# EAGLE design Adafruit Feather M0 Express test (EAGLE 9.5.2)
COMPANY: ADAFRUIT INDUSTRIES; DRAWN: KTOWN; REV: B
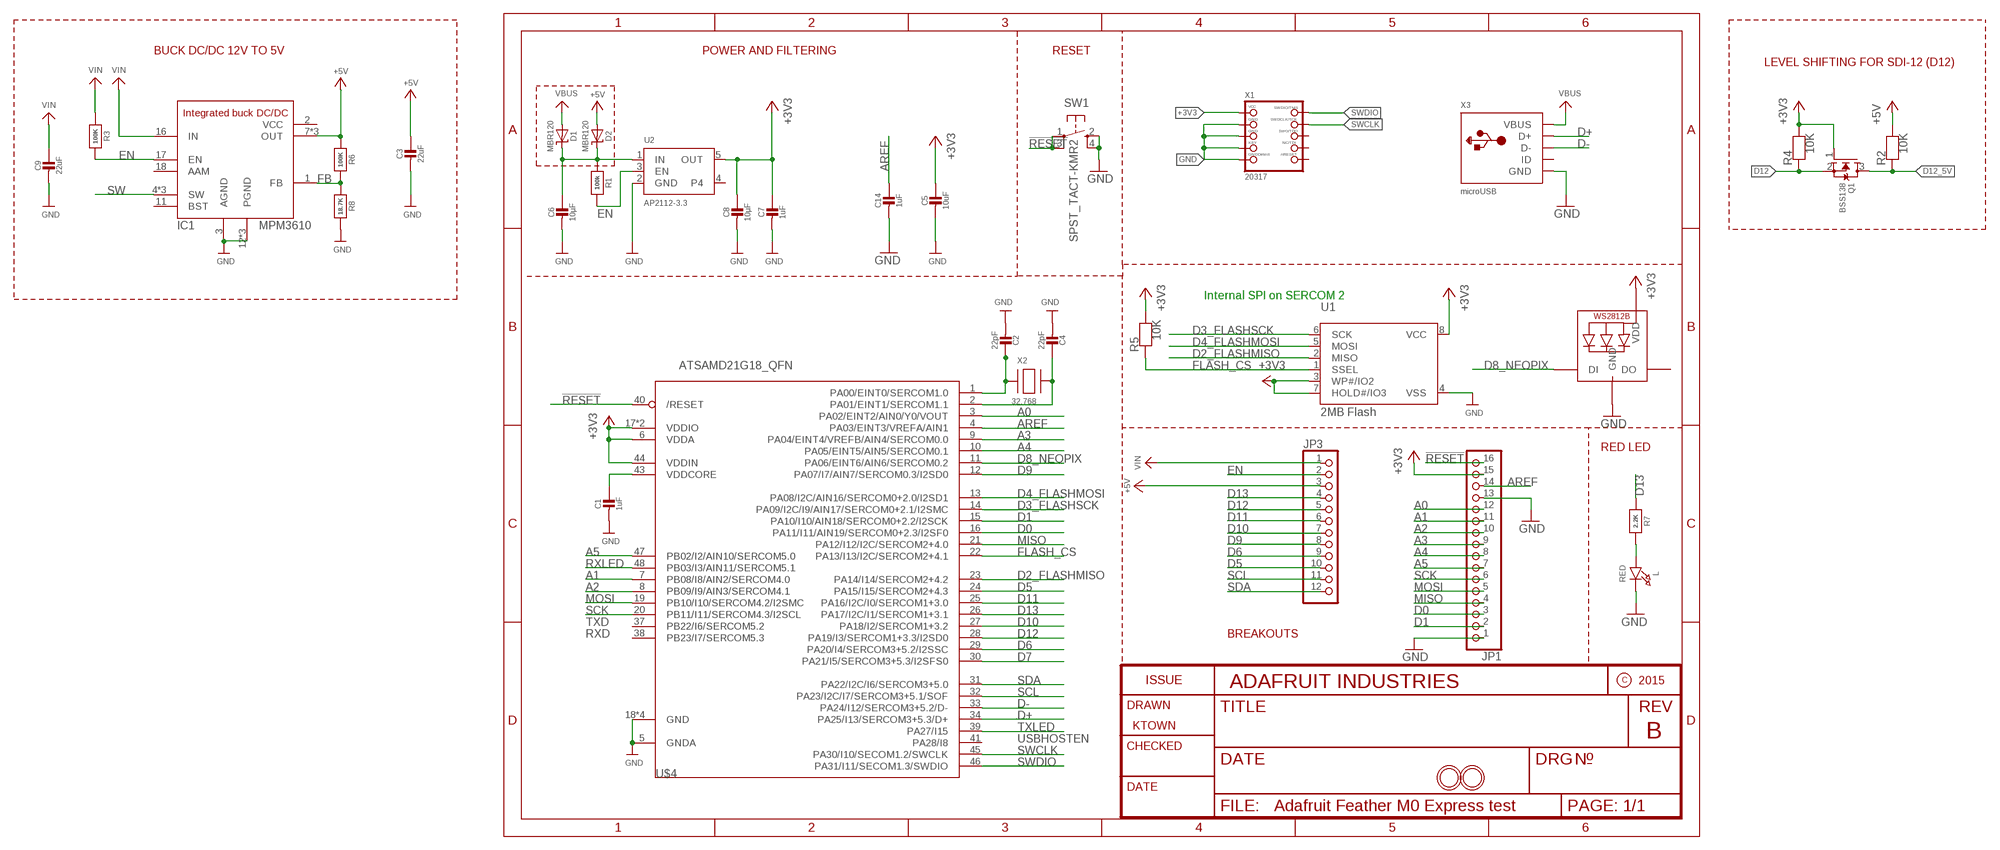
[diagram p0: schematic, sheet 1]

## Parts
C1  1uF  CAP_CERAMIC0603_NO  [0603-NO]
C2  22pF  CAP_CERAMIC0603_NO  [0603-NO]
C3  22uF  CAP_CERAMIC0805-NOOUTLINE  [0805-NO]
C4  22pF  CAP_CERAMIC0603_NO  [0603-NO]
C5  10uF  CAP_CERAMIC0805-NOOUTLINE  [0805-NO]
C6  10µF  CAP_CERAMIC0805-NOOUTLINE  [0805-NO]
C7  1uF  CAP_CERAMIC0603_NO  [0603-NO]
C8  10µF  CAP_CERAMIC0805-NOOUTLINE  [0805-NO]
C9  22uF  CAP_CERAMIC0805-NOOUTLINE  [0805-NO]
C14  1uF  CAP_CERAMIC0603_NO  [0603-NO]
D1  MBR120  DIODE-SCHOTTKYSOD-123  [SOD-123]
D2  MBR120  DIODE-SCHOTTKYSOD-123  [SOD-123]
IC1  MPM3610  [MPM3610]
JP1  HEADER-1X16ROUND  [1X16_ROUND]
JP3  HEADER-1X12  [1X12_ROUND]
L  RED  LED0805_NOOUTLINE  [CHIPLED_0805_NOOUTLINE]
LED1  WS2812B3535  [LED3535]
Q1  BSS138  MOSFET-NREFLOW  [SOT23]
R1  100k  RESISTOR_0603_NOOUT  [0603-NO]
R2  10K  RESISTOR_0603_NOOUT  [0603-NO]
R3  100K  RESISTOR_0603_NOOUT  [0603-NO]
R4  10K  RESISTOR_0603_NOOUT  [0603-NO]
R5  10K  RESISTOR_0603_NOOUT  [0603-NO]
R6  100K  RESISTOR_0603_NOOUT  [0603-NO]
R7  2.2K  RESISTOR_0603_NOOUT  [0603-NO]
R8  18.7K  RESISTOR_0603_NOOUT  [0603-NO]
SW1  SPST_TACT-KMR2  [KMR2]
U1  2MB Flash  SPIFLASH_SOIC8208MIL  [SOIC8_208MIL]
U2  AP2112-3.3  VREG_SOT23-5  [SOT23-5]
U$4  ATSAMD21G18_QFN  ATSAMD21G_QFN  [TQFN48_7MM]
U$31  MOUNTINGHOLE2.5  [MOUNTINGHOLE_2.5_PLATED]
U$32  MOUNTINGHOLE2.5  [MOUNTINGHOLE_2.5_PLATED]
X1  20317  JTAG-CORTEXBOXPOSTS  [2X05_1.27MM_BOX_POSTS]
X2  32.768  XTAL-3.2X1.5  [XTAL3215]
X3  microUSB  USB_MICRO_20329_V2  [4UCONN_20329_V2]

## Nets
!RESET: JP1.16 SW1.1(P) SW1.3(P1) U$4.40(/RESET)
+3V3: C5.1 C7.1 C8.1 JP1.15 LED1.2(VDD) Q1.1(G) R4.2 R5.2 U1.3(WP#/IO2) U1.7(HOLD#/IO3) U1.8(VCC) U2.5(OUT) U$4.6(VDDA) U$4.17(VDDIO) U$4.36(VDDIO) U$4.44(VDDIN) X1.1(VCC)
+5V: C3.1 D2.A IC1.7(OUT) IC1.8(OUT) IC1.9(OUT) JP3.3 R2.2 R6.1
A0: JP1.12 U$4.3(PA02/EINT2/AIN0/Y0/VOUT)
A1: JP1.11 U$4.7(PB08/I8/AIN2/SERCOM4.0)
A2: JP1.10 U$4.8(PB09/I9/AIN3/SERCOM4.1)
A3: JP1.9 U$4.9(PA04/EINT4/VREFB/AIN4/SERCOM0.0)
A4: JP1.8 U$4.10(PA05/EINT5/AIN5/SERCOM0.1)
A5: JP1.7 U$4.47(PB02/I2/AIN10/SERCOM5.0)
AREF: C14.1 JP1.14 U$4.4(PA03/EINT3/VREFA/AIN1)
D0: JP1.3 U$4.16(PA11/I11/AIN19/SERCOM0+2.3/I2SF0)
D1: JP1.2 U$4.15(PA10/I10/AIN18/SERCOM0+2.2/I2SCK)
D2_FLASHMISO: U1.2(MISO) U$4.23(PA14/I14/SERCOM2+4.2)
D3_FLASHSCK: U1.6(SCK) U$4.14(PA09/I2C/I9/AIN17/SERCOM0+2.1/I2SMC)
D4_FLASHMOSI: U1.5(MOSI) U$4.13(PA08/I2C/AIN16/SERCOM0+2.0/I2SD1)
D5: JP3.10 U$4.24(PA15/I15/SERCOM2+4.3)
D6: JP3.9 U$4.29(PA20/I4/SERCOM3+5.2/I2SSC)
D7: U$4.30(PA21/I5/SERCOM3+5.3/I2SFS0)
D8_NEOPIX: LED1.1(DI) U$4.11(PA06/EINT6/AIN6/SERCOM0.2)
D9: JP3.8 U$4.12(PA07/I7/AIN7/SERCOM0.3/I2SD0)
D10: JP3.7 U$4.27(PA18/I2/SERCOM1+3.2)
D11: JP3.6 U$4.25(PA16/I2C/I0/SERCOM1+3.0)
D12: JP3.5 Q1.2(S) R4.1 U$4.28(PA19/I3/SERCOM1+3.3/I2SD0)
D12_5V: Q1.3(D) R2.1
D13: JP3.4 R7.1 U$4.26(PA17/I2C/I1/SERCOM1+3.1)
D+: U$4.34(PA25/I13/SERCOM3+5.3/D+) X3.D+
D-: U$4.33(PA24/I12/SERCOM3+5.2/D-) X3.D-
EN: IC1.17(EN) JP3.2 R1.2 R3.2 U2.3(EN)
FB: IC1.1(FB) R6.2 R8.1
FLASH_CS: R5.1 U1.1(SSEL) U$4.22(PA13/I13/I2C/SERCOM2+4.1)
GND: C1.2 C2.2 C3.2 C4.2 C5.2 C6.2 C7.2 C8.2 C9.2 C14.2 IC1.3(AGND) IC1.12(PGND) IC1.13(PGND) IC1.14(PGND) JP1.1 JP1.13 L.C LED1.4(GND) R8.2 SW1.2(S) SW1.4(S1) U1.4(VSS) U2.2(GND) U$4.5(GNDA) U$4.18(GND) U$4.35(GND) U$4.42(GND) U$4.THERMAL(GND) X1.3(GND) X1.5(GND) X1.7(KEY) X1.9(GNDDETECT) X3.BASE@1(GND) X3.BASE@2(GND) X3.GND X3.SPRT@1(GND) X3.SPRT@2(GND) X3.SPRT@3(GND) X3.SPRT@4(GND)
MISO: JP1.4 U$4.21(PA12/I12/I2C/SERCOM2+4.0)
MOSI: JP1.5 U$4.19(PB10/I10/SERCOM4.2/I2SMC)
N$1: C6.1 D1.C D2.C R1.1 U2.1(IN)
N$2: L.A R7.2
N$5: C2.1 U$4.1(PA00/EINT0/SERCOM1.0) X2.P$1
N$7: C4.1 U$4.2(PA01/EINT1/SERCOM1.1) X2.P$2
RXLED: U$4.48(PB03/I3/AIN11/SERCOM5.1)
SCK: JP1.6 U$4.20(PB11/I11/SERCOM4.3/I2SCL)
SCL: JP3.11 U$4.32(PA23/I2C/I7/SERCOM3+5.1/SOF)
SDA: JP3.12 U$4.31(PA22/I2C/I6/SERCOM3+5.0)
SW: IC1.4(SW) IC1.5(SW) IC1.6(SW)
SWCLK: U$4.45(PA30/I10/SECOM1.2/SWCLK) X1.4(SWDCLK)
SWDIO: U$4.46(PA31/I11/SECOM1.3/SWDIO) X1.2(SWDIO)
TXLED: U$4.39(PA27/I15)
VBUS: D1.A X3.VBUS
VDDCORE: C1.1 U$4.43(VDDCORE)
VIN: C9.1 IC1.16(IN) JP3.1 R3.1
Unconnected: IC1.11(BST) IC1.18(AAM) LED1.3(DO) U2.4 U$4.37(PB22/I6/SERCOM5.2) U$4.38(PB23/I7/SERCOM5.3) U$4.41(PA28/I8) X1.6(SWO) X1.8(TDI) X1.10(NRESET) X3.ID

## Notes on the sheet
- BUCK DC/DC 12V TO 5V | POWER AND FILTERING | RESET
- LEVEL SHIFTING FOR SDI-12 (D12)
- Internal SPI on SERCOM 2
- RED LED
- TXD
- RXD | BREAKOUTS
- USBHOSTEN

## Power pins joined to a net without a drawn wire
VCC: IC1.2(VCC)

## Library data of the parts
C1-C9 C14 = microbuilder:CAP_CERAMIC: Ceramic Capacitors For new designs, use the packages preceded by an '_' character since they are more reliable: The following footprints should be used on most boards: _0402 - Standard footprint for regular board layouts _0603 - Standard footprint for regular board layouts _0805 - Standard footprint for regular board layouts _1206 - Standard footprint for regular board layouts For extremely tight-pitch boards where space is at a premium, the following 'micro-pitch' footprints can be used (smaller pads, no silkscreen outline, etc.): _0402MP - Micro-pitch footprint for very dense/compact boards _0603MP - Micro-pitch footprint for very dense/compact boards _0805MP - Micro-pitch footprint for very dense/compact boards _1206MP - Micro-pitch footprint for very dense/compact boards
D1 D2 = microbuilder:DIODE-SCHOTTKY
IC1 = microbuilder:MPM3610
JP1 = microbuilder:HEADER-1X16: PIN HEADER
JP3 = microbuilder:HEADER-1X12
L = microbuilder:LED: LED 0603 - 0603 Surface Mount Package 2mA: Green LED - Low Power (3.9mcd, 2ma, 1.7Vf) - Digikey: 475-2709-2-ND Orange LED - Low Power (9.8mcd, 2ma, 1.8Vf) - Digikey: 475-1194-2-ND Red LED - Low Power (5mcd, 2ma, 1.8Vf) - Digikey: 475-1195-2-ND Yellow LED - Low Power (7mcd, 2ma, 1.8Vf) - Digikey: 475-1196-2-ND 5mA: Blue LED - Low Power (17mcd, 5ma, 2.9Vf) - Digikey: LNJ937W8CRACT-ND 0805 - 0805 Surface Mount Package 2mA: Red LED (8.8mcd, 2mA, 1.8Vf, Clear) - Low Power [Digikey: 475-2510-1-ND] Green LED (5mcd, 2mA, 1.8Vf, Clear) - Low Power [Digikey: 475-2730-1-ND] Yellow LED (11.3mcd, 2mA, 1.8Vf, Clear) - Low Power [Digikey: 475-2555-1-ND] 20mA: Red LED (104mcd, 20mA, Diffused) - LS R976 [Digikey: 475-1278-6-ND] Red LED (12mcd, 20mA, 2.0Vf, Clear) - APT2012EC [Digikey: 754-1128-1-ND] Green LED (15mcd, 20mA, 2.2Vf, Clear) - APT2012GC [Digikey: 754-1131-1-ND] Orange LED (160mcd, 20mA, 2.1Vf, Clear) - APT2012SECK [Digikey: 754-1130-1-ND] 1206 - 1206 Surface Mount Package Green LED (26mcd, 20mA, Diffused) - LG N971 [Digikey: 475-1407-6-ND] Red LED (15mcd, 20mA, Diffused) - LH N974 [Digikey: 475-1416-6-ND] Cree - Cree High-Power Surface Mount LEDs XPEBWT-L1-0000-00D50 - White 111lm 350mA 2.9Vf 6200K 110° XTEAWT-00-0000-00000LEE3 - White 114lm 350mA 2.85Vf 5000K 115° Everlight - Everlight 45-21 Series Surface Mount LEDs 45-21/QK2C-B2832AC2CB2/2T - Warm White 2000mcd 20mA 3.25Vf 3050K 120° 45-21/LK2C-B38452C4CB2/2T - Nuetral White 2000mcd 20mA 3.25Vf 4150K 120° 45-21/LK2C-B50634C6CB2/2T - Cold White 2200mcd 20mA 3.25Vf 5650K 120° PLCC2 Reverse Mount LS T77K-J1L2-1-0-2-R18-Z - Red 11.25mcd 2mA 1.8Vf 630nm 120° LO T77K-L1M2-24-Z - Orange 19.6mcd 2mA 1.8Vf 606nm 120° LY T77K-K2M1-26-Z - Yellow 15.7mcd 2mA 1.8Vf 587nm 120°
LED1 = microbuilder:WS2812B
Q1 = adafruit:MOSFET-N: N-Channel Mosfet 2N7002E - 60V 260mA SOT23 [Digikey: 2N7002ET1GOSTR-ND] - REEL BSH103 - 30V 850mA SOT23 [Digikey: 568-5013-1-ND]
R1-R8 = microbuilder:RESISTOR: Resistors For new designs, use the packages preceded by an '_' character since they are more reliable: The following footprints should be used on most boards: _0402 - Standard footprint for regular board layouts _0603 - Standard footprint for regular board layouts _0805 - Standard footprint for regular board layouts _1206 - Standard footprint for regular board layouts For extremely tight-pitch boards where space is at a premium, the following 'micro-pitch' footprints can be used (smaller pads, no silkscreen outline, etc.): _0402MP - Micro-pitch footprint for very dense/compact boards _0603MP - Micro-pitch footprint for very dense/compact boards _0805MP - Micro-pitch footprint for very dense/compact boards _1206MP - Micro-pitch footprint for very dense/compact boards
SW1 = adafruit:SPST_TACT: SMT 6mm switch, EVQQ2 series http://www.ladyada.net/library/eagle
U1 = microbuilder:SPIFLASH_SOIC8: SOIC8 SPI Flash Be careful with the size since SOIC8 flash comes in several 'widths' SOIC8 150 mil M25P16 - 16Mbit (2Mbit x 8) Serial Flash (75MHz SPI Bus), Supply: 2.7-3.6V Digikey: SOIC8 - M25P16-VMN6P-ND SOIC8 208 mil W25Q16BVSSIG - 16Mbit (2Mbit x 8) Serial Flash (104MHz SPI Bus), Supply: 2.7-3.6V Digikey: SOIC8 - W25Q16BVSSIG-ND
U2 = microbuilder:VREG_SOT23-5: SOT23-5 Fixed Voltage Regulators Part Current Out V Out V In V Dropout θJA (°C/W) TJ (°C) Digikey Part No. ADP121 150mA 3.3V 3.4-5.5V 0.09V @ 150mA -- -- ADP121-AUJZ33R7CT-ND ADP121 150mA 3.0V 3.1-5.5V 0.09V @ 150mA -- -- ADP121-AUJZ30R7CT-ND ADP122 300mA 3.3V 3.4-5.5V 0.085V @ 300mA -- -- ADP122AUJZ-3.3-R7CT-ND ADP1712 300mA 3.3V 3.5-5.5V 0.17V @ 300mA -- -- ADP1712AUJZ-3.3-R7TR-ND AP7311 (Low Cost) 150mA 3.3V 3.5-6V 0.15V @ 150mA -- -- AP7311-33WG-7DICT-ND LD39015M18R 150mA 1.8V 1.9V-5.5V 0.08V @ 100mA -- -- 497-6977-1-ND LP2985A-33DBVR 150mA 3.3V 3.3-16V 0.28V @ 150mA 206 150 296-18479-1-ND MCP1824T-3302E/OT 300mA 3.3V 3.5V-6V 0.2V @ 300mA -- -- MCP1824T-3302E/OTCT-ND MIC5205-2.5YM5 TR 150mA 2.5V 2.7-16V 0.165V @ 150mA -- -- 576-1257-2-ND MIC5205-3.0YM5 TR 150mA 3.0V 3.2V-16V 0.165V @ 150mA -- -- 576-1258-2-ND MIC5205-3.3YM5 TR 150mA 3.3V 3.5V-16V 0.165V @ 150mA -- -- 576-1259-2-ND TPS780330220 150mA 3.3V+2.2V 3.6-5.5V 250mV Max -- -- 296-23332-1-ND TDA3663/N1,135 100mA 3.3V 3.5-45V 0.18V @ 50mA -- -- 568-5343-1-ND Max operating temp can be calculated using θJA, TJ (max junction temperature), and power in watts. Set the "Maximum Ambient Temperature" until it reaches TJ ("Max Junction Temperature"), which is the absolute limit for safe use of the regulator: Heat Sink Temperature Calculator <http://www.daycounter.com/Calculators/Heat-Sink-Temperature-Calculator.phtml> For example, With 12V source into a 3.3V LP2985 and a 30mA load, we are dissipating (12V-3.3V) * 0.03A = 0.261W. With a θJA of 206 °C/W, a TJ of 150°C, and 261mW we can safely use the chip without a heat sink up to 75°C (=147.1°C Junction Temperature).
U$4 = microbuilder:ATSAMD21G
U$31 U$32 = microbuilder:MOUNTINGHOLE: Mounting Hole For #2 screws (0.086"/2.18mm width, 0.094"/2.4mm hole) use 2.5mm; BOM: EXCLUDE
X1 = microbuilder:JTAG-CORTEX: Serial Wire (SW-DP) Connector Standard 0.05" 10-pin connector is for use with the Cortex M and Cortex A SWD (serial wire debugger) interface (SW-DP) Connectors 2x05_1.27MM_SMT - Inexpensive surface-mount header with bare pins, compatible with standard 10-pin SWD cables (4UCON: 16846) 2x05_1.27MM_BOX_NOPOSTS - Polarised surface-mount box (4UCON with caps: 19735, without caps: 15117 2x05_1.27MM_BOX_POSTS - Polarised surface-mount box with mounting holes (4UCON: 20317) Pinout: http://infocenter.arm.com/help/topic/com.arm.doc.faqs/attached/13634/cortex_debug_connectors.pdf http://www.keil.com/peripherals/coresight/connectors.asp
X2 = adafruit2:XTAL: Low cost SMT crystals, no capacitors included http://www.ladyada.net/library/eagle
X3 = microbuilder:USB: USB Connectors USBMINIB - Surface Mount Female Mini-B USB Connector 4UConnector: 06564

## Board
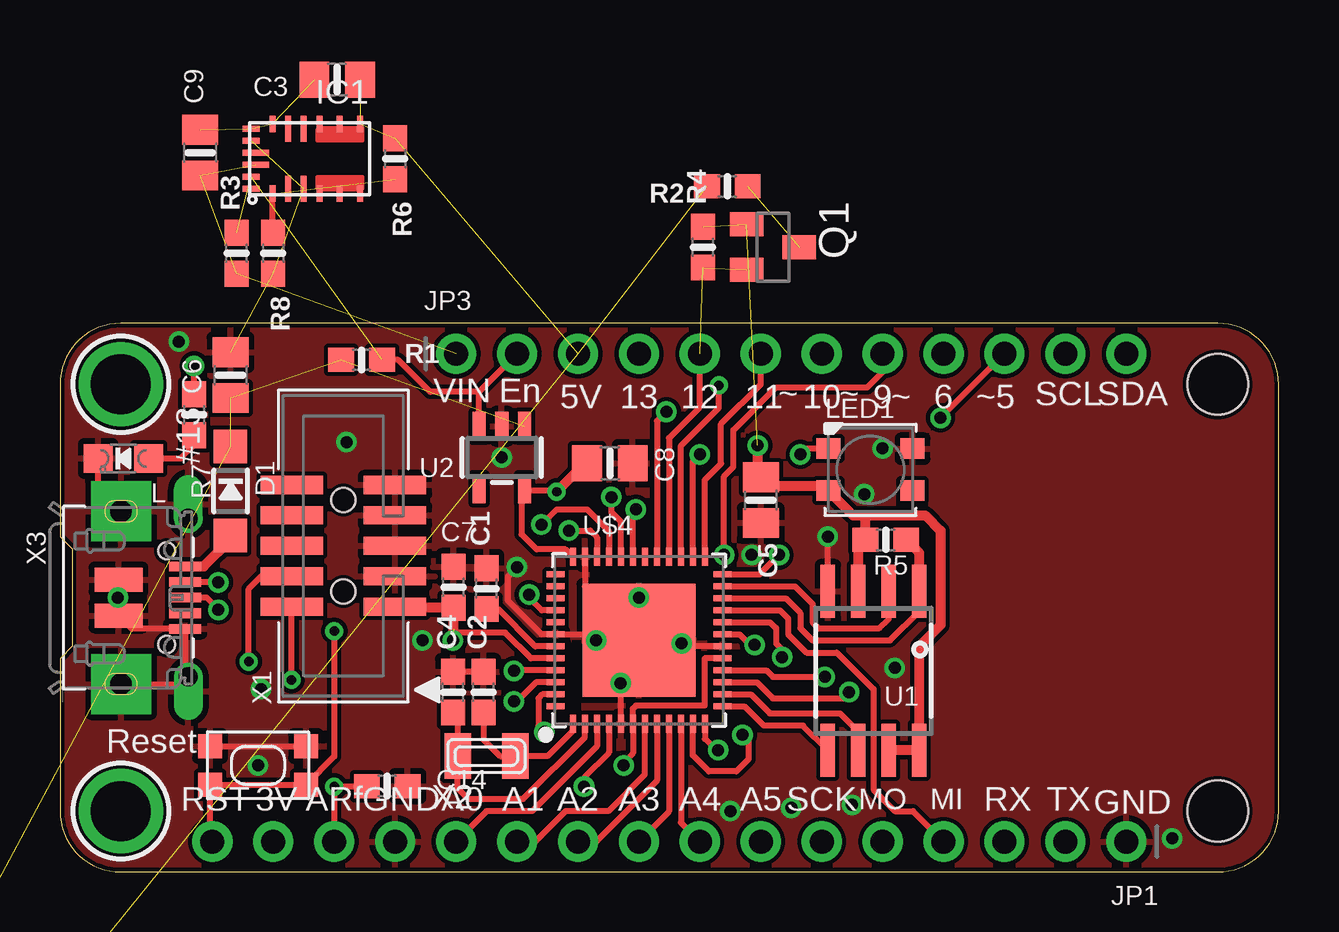
[diagram p1: board, top side]
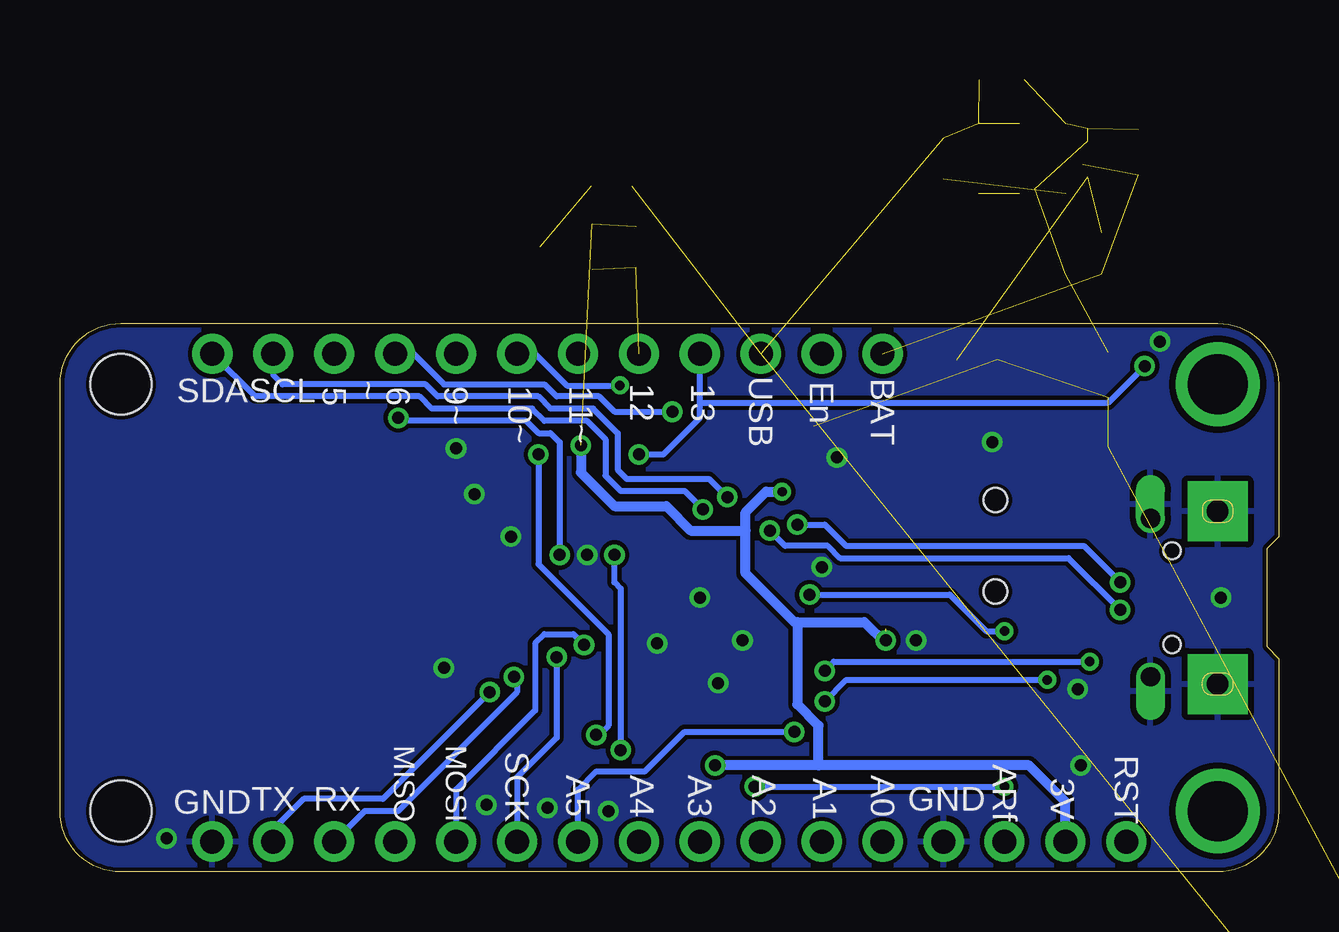
[diagram p2: board, bottom side, seen from below]

Size 50.8 x 22.86 mm. Coordinates in mm from the lower left corner, seen from the top.
Outline: 2.54,0 48.26,0 arc90 50.8,2.54 50.8,20.32 arc90 48.26,22.86 2.54,22.86 arc90 0,20.32 0,13.97 0.51,13.46 0.51,9.4 0,8.89 0,2.54 arc90 2.54,0
Copper layers (1*16): Top 0.035mm / dielectric 1.5mm / Bottom 0.035mm
Design rules "SparkFun-2-layer-TIGHT *": minimum track width 7mil, minimum drill 15mil, track to track 7mil, track to pad 7mil, pad to pad 7mil, via to via 7mil, smd to smd 7mil, copper to edge 7mil, drill to drill 7mil, minimum pad ring 7mil, minimum via ring 7mil, stop-mask expansion 4mil, vias tented up to drill 25mil, thermal gap 10mil
Holes 2.54 mm at 48.26,20.32 48.26,2.54
tRestrict: area 21.3,6.9 to 21.7,9.7; area 22.1,12.1 to 27.1,12.4; area 26.5,9.7 to 27.1,12.2

### Footprints (pad centres in the part's own frame; a part is rotated, then mirrored left to right if it is on the bottom)
0603-NO = smd 1.075 x 1: 1 -0.85,0; 2 0.85,0
0805-NO = smd 1.24 x 1.5: 1 -0.95,0; 2 0.95,0
SOD-123 = smd 1.4 x 1.4: A 1.85,0; C -1.85,0
MPM3610 = smd 0.7 x 0.25: 1 -1.45,1.55; 4 -1.45,-0.4; 5 -1.45,-1.25; 6 -1.45,-2.1; 7 1.45,-2.1; 8 1.45,-1.25; 9 1.45,-0.4; 12 1.45,1.55 | smd 1.1 x 0.25: 2 -1.25,0.9; 3 -1.25,0.25; 10 1.25,0.25; 11 1.25,0.9 | smd 0.25 x 0.7: 13 1.25,2.45; 14 0.75,2.45; 17 -0.75,2.45; 18 -1.25,2.45 | smd 0.25 x 1.1: 15 0.25,2.25; 16 -0.25,2.25
1X16_ROUND = drill 1 pad 1.676: 1 -19.05,0; 2 -16.51,0; 3 -13.97,0; 4 -11.43,0; 5 -8.89,0; 6 -6.35,0; 7 -3.81,0; 8 -1.27,0; 9 1.27,0; 10 3.81,0; 11 6.35,0; 12 8.89,0; 13 11.43,0; 14 13.97,0; 15 16.51,0; 16 19.05,0
1X12_ROUND = drill 1 pad 1.676: 1 -13.97,0; 2 -11.43,0; 3 -8.89,0; 4 -6.35,0; 5 -3.81,0; 6 -1.27,0; 7 1.27,0; 8 3.81,0; 9 6.35,0; 10 8.89,0; 11 11.43,0; 12 13.97,0
CHIPLED_0805_NOOUTLINE = smd 1.2 x 1.2: A 0,-1.05; C 0,1.05
LED3535 = smd 1 x 0.85: 1 -1.75,0.875; 2 -1.75,-0.875; 3 1.75,-0.875; 4 1.75,0.875
SOT23 = smd 1 x 1.4: 1 -0.95,-1.1; 2 0.95,-1.1; 3 0,1.1
KMR2 = smd 1 x 1: 1 2,0.8; 2 2,-0.8; 3 -2,0.8; 4 -2,-0.8
SOIC8_208MIL = smd 0.6 x 2.2: 1 -1.905,-3.315; 2 -0.635,-3.315; 3 0.635,-3.315; 4 1.905,-3.315; 5 1.905,3.315; 6 0.635,3.315; 7 -0.635,3.315; 8 -1.905,3.315
SOT23-5 = smd 0.55 x 1.2: 1 -0.95,-1.3; 2 0,-1.3; 3 0.95,-1.3; 4 0.95,1.3; 5 -0.95,1.3
TQFN48_7MM = smd 0.25 x 0.75: 1 -2.75,-3.475; 2 -2.25,-3.475; 3 -1.75,-3.475; 4 -1.25,-3.475; 5 -0.75,-3.475; 6 -0.25,-3.475; 7 0.25,-3.475; 8 0.75,-3.475; 9 1.25,-3.475; 10 1.75,-3.475; 11 2.25,-3.475; 12 2.75,-3.475; 25 2.75,3.475; 26 2.25,3.475; 27 1.75,3.475; 28 1.25,3.475; 29 0.75,3.475; 30 0.25,3.475; 31 -0.25,3.475; 32 -0.75,3.475; 33 -1.25,3.475; 34 -1.75,3.475; 35 -2.25,3.475; 36 -2.75,3.475 | smd 0.75 x 0.25: 13 3.475,-2.75; 14 3.475,-2.25; 15 3.475,-1.75; 16 3.475,-1.25; 17 3.475,-0.75; 18 3.475,-0.25; 19 3.475,0.25; 20 3.475,0.75; 21 3.475,1.25; 22 3.475,1.75; 23 3.475,2.25; 24 3.475,2.75; 37 -3.475,2.75; 38 -3.475,2.25; 39 -3.475,1.75; 40 -3.475,1.25; 41 -3.475,0.75; 42 -3.475,0.25; 43 -3.475,-0.25; 44 -3.475,-0.75; 45 -3.475,-1.25; 46 -3.475,-1.75; 47 -3.475,-2.25; 48 -3.475,-2.75 | smd 4.7 x 4.7: THERMAL 0,0
MOUNTINGHOLE_2.5_PLATED = drill 2.5 pad 3.2: P$1 0,0
2X05_1.27MM_BOX_POSTS = smd 0.76 x 2.6: 1 -2.54,-2.15; 2 -2.54,2.15; 3 -1.27,-2.15; 4 -1.27,2.15; 5 0,-2.15; 6 0,2.15; 7 1.27,-2.15; 8 1.27,2.15; 9 2.54,-2.15; 10 2.54,2.15 | hole 1: -1.905,0; 1.905,0
XTAL3215 = smd 1.1 x 1.9: P$1 1.2,0; P$2 -1.2,0
4UCONN_20329_V2 = smd 1 x 2: BASE@1 -0.75,-2; BASE@2 0.75,-2 | smd 0.4 x 1.35: D+ 0,0.775; D- -0.65,0.775; GND 1.3,0.775; ID 0.65,0.775; VBUS -1.3,0.775 | drill 0.8 pad 1.2 offset: SPRT@1 -3.3,0.9; SPRT@2 3.3,0.9 | drill 0.9 pad 2.5 square: SPRT@3 -3.6,-1.9; SPRT@4 3.6,-1.9 | hole 0.7: -1.95,0; 1.95,0

### Placement (x,y rotation side)
C1  17.78,11.81 90 top
C2  17.65,7.49 90 top
C3  11.56,33.02 180 top  (outside the outline)
C4  16.38,7.49 90 top
C5  29.21,15.49 270 top
C6  7.11,20.7 90 top
C7  16.4,11.86 90 top
C8  22.92,17.03 0 top
C9  5.84,29.97 90 top  (outside the outline)
C14  13.64,3.58 0 top
D1  7.11,15.88 270 top
D2  -5.97,-10.16 0 top  (outside the outline)
IC1  10.41,29.72 90 top  (outside the outline)
JP1  25.4,1.27 180 top
JP3  30.48,21.59 0 top
L  2.65,17.23 90 top
LED1  33.78,16.76 0 top
Q1  29.72,26.04 270 top
R1  12.57,21.34 0 top
R2  27.81,28.57 180 top  (outside the outline)
R3  7.37,25.78 90 top
R4  26.8,26.04 90 top
R5  34.42,13.84 180 top
R6  13.97,29.72 270 top  (outside the outline)
R7  5.59,19.05 270 top
R8  8.89,25.78 270 top
SW1  8.26,4.45 180 top
U1  33.91,8.38 180 top
U2  18.41,17.27 180 top
U$4  24.13,9.65 0 top
U$31  2.54,20.32 270 top
U$32  2.54,2.54 270 top
X1  11.81,13.59 90 top
X2  17.78,4.83 0 top
X3  4.45,11.43 270 top

### Tracks (layer width: path | path; a pad name or v marks a point on that pad's centre or on a via)
!RESET  (via drill 0.39, 0.5)
  Top 0.254: U$4.40 20.09,10.9 19.56,11.43 v19.56,11.56 | JP1.16 6.25,1.36 SW1.1 SW1.3 11.43,4.82 v11.43,10.03
  Bottom 0.254: v19.56,11.56 13.72,11.56 12.19,10.03 v11.43,10.03
+3V3  (via drill 0.39, 0.5)  (3 unrouted)
  Top 0.254: U$4.44 19.63,8.9 18.56,9.97 16.57,9.97 16.4,10.14 | v23.5,4.45 23.5,4.56 23.88,4.95 U$4.6 23.88,6.81 24,6.93 26.87,6.93 26.87,8.9 U$4.17 | 16.4,10.04 C7.1 | U2.5 19.36,16.44 | U2.5 19.46,15.88 20.7,15.88 v20.7,15.84 | U$4.36 21.07,13.44 19.87,13.44 19.24,14.07 19.24,15.85 U2.5
  Top 0.406: v29.08,17.78 29.08,16.57 C5.1 29.59,16.06 31.86,16.06 LED1.2 33.06,14.86 33.66,14.86 | v16.38,9.65 16.38,10.99 C7.1 14,11.01 X1.1 | U1.7 U1.8 35.81,9.4 36.7,10.29 36.7,14.22 36.07,14.86 33.66,14.86 | 33.66,14.86 33.57,14.77 R5.2 33.27,13.55 U1.3 | v20.7,15.84 21.89,17.03 C8.1
  Bottom 0.406: 22.23,14.22 22.23,12.45 20.19,10.41 20.07,10.41 | 22.23,14.22 22.23,14.99 21.37,15.84 v20.7,15.84 | 20.07,10.41 17.27,10.41 16.38,9.53 v16.38,9.65 | v29.08,17.78 29.08,16.64 27.69,15.24 25.53,15.24 24.51,14.22 22.23,14.22 | 20.07,10.41 20.07,6.99 19.18,6.1 19.18,4.45 | JP1.15 8.89,2.92 10.41,4.45 19.18,4.45 | 19.18,4.45 v23.5,4.45
+5V  (7 unrouted)
  Top 0.813: C3.1
A0
  Top 0.254: U$4.3 22.38,5.24 19.68,2.54 17.78,2.54 JP1.12
A1
  Top 0.254: U$4.7 24.38,4.06 22.86,2.54 21.08,2.54 19.81,1.27 JP1.11
A2
  Top 0.254: U$4.8 24.88,3.8 22.35,1.27 JP1.10 21.84,1.27
A3
  Top 0.254: U$4.9 25.38,2.52 JP1.9
A4
  Top 0.254: U$4.10 25.88,2.06 JP1.8
A5  (via drill 0.5)
  Top 0.254: U$4.47 20.1,7.4 19.94,7.24 19.94,6.1 v20.19,5.84
  Bottom 0.254: JP1.7 29.21,3.43 28.45,4.19 26.42,4.19 24.77,5.84 v20.19,5.84
AREF  (via drill 0.39, 0.5)
  Top 0.254: 12.79,3.27 C14.1 11.46,3.58 v11.43,3.56 JP1.14 | U$4.4 22.88,4.97 21.84,3.94 v21.84,3.56
  Bottom 0.254: v21.84,3.56 v11.43,3.56
D0  (via drill 0.5)
  Top 0.254: U$4.16 29.44,8.4 29.72,8.13 v31.88,8.13
  Bottom 0.254: v31.88,8.13 31.75,8 31.75,7.49 36.7,2.54 38.1,2.54 JP1.3
D1  (via drill 0.5)
  Top 0.254: U$4.15 29.05,7.9 29.72,7.24 32.64,7.24 v32.89,7.49
  Bottom 0.254: v32.89,7.49 37.34,3.05 40.64,3.05 41.91,1.78 JP1.2
D2_FLASHMISO
  Top 0.254: U$4.23 30.64,11.9 31.37,11.18 31.37,10.41 31.62,10.16 34.16,10.16 34.54,10.54 U1.2
D3_FLASHSCK
  Top 0.254: U$4.14 28.79,7.4 29.59,6.6 32.51,6.6 33.15,5.97 33.15,5.19 U1.6
D4_FLASHMOSI
  Top 0.254: U$4.13 28.53,6.9 29.34,6.1 30.98,6.1 U1.5
D5  (via drill 0.5)
  Top 0.254: JP3.10 v36.7,18.92 | U$4.24 29.17,12.4 v29.97,13.21
  Bottom 0.254: v29.97,13.21 29.97,17.91 30.35,18.29 30.86,18.29 31.37,18.8 36.58,18.8 v36.7,18.92
D6  (via drill 0.5)
  Top 0.254: v25.27,19.18 24.88,18.78 U$4.29
  Bottom 0.254: JP3.9 36.07,21.59 34.8,20.32 30.61,20.32 30.1,19.81 28.32,19.81 27.69,19.18 v25.27,19.18
D8_NEOPIX  (via drill 0.5)
  Top 0.254: LED1.1 31.1,17.64 v30.86,17.4 | v28.45,5.71 28.7,5.46 28.7,4.7 28.19,4.19 27.05,4.19 26.38,4.86 U$4.11
  Bottom 0.254: v30.86,17.4 30.86,12.83 27.94,9.91 27.94,6.1 28.32,5.71 v28.45,5.71
D9  (via drill 0.5)
  Top 0.254: JP3.8 34.29,20.83 33.66,20.19 29.84,20.19 28.07,18.41 28.07,16.88 27.69,16.5 v27.69,13.21 | U$4.12 26.88,5.54 27.34,5.08 v27.43,5.08
  Bottom 0.254: v27.43,5.08 27.43,11.81 27.69,12.06 v27.69,13.21
D10  (via drill 0.39)
  Top 0.254: U$4.27 25.88,17.75 27.46,19.34 v27.46,20.28
  Bottom 0.254: JP3.7 30.99,21.59 29.67,20.27 27.47,20.27 v27.46,20.28
D11
  Top 0.254: U$4.25 26.88,16.34 27.56,17.02 27.56,18.67 29.21,20.32 JP3.6
D12  (2 unrouted)
  Top 0.254: U$4.28 25.38,18.08 26.65,19.35 26.65,21.57 JP3.5
D12_5V  (1 unrouted)
D13  (via drill 0.5)
  Top 0.254: U$4.26 26.38,17.11 v26.67,17.4 | R7.1 v5.59,21.08
  Bottom 0.254: 24.13,19.56 7.11,19.56 v5.59,21.08 | v26.67,17.4 25.65,17.4 24.13,18.92 24.13,19.56 | 24.13,19.56 JP3.4
D+  (via drill 0.5)
  Top 0.254: v6.6,10.92 6.6,10.94 6.11,11.43 X3.D+ | v21.21,14.22 22.1,14.22 22.38,13.94 U$4.34
  Bottom 0.254: v6.6,10.92 8.76,13.08 18.29,13.08 18.8,13.59 20.57,13.59 v21.21,14.22
D-  (via drill 0.5)
  Top 0.254: v6.6,12.06 6.59,12.08 X3.D- | v20.07,14.48 20.7,15.11 21.97,15.11 22.88,14.2 U$4.33
  Bottom 0.254: v20.07,14.48 18.92,14.48 18.03,13.59 8.13,13.59 v6.6,12.06
EN  (2 unrouted)
  Top 0.254: R1.2 14.1,21.34 15.43,20 17.46,20 | U2.3 17.46,20 | 17.46,20 JP3.2
FB  (1 unrouted)
  Top 0.254: R8.1 8.85,28.25 IC1.1
FLASH_CS
  Top 0.254: U$4.22 30.25,11.4 30.86,10.79 30.86,10.16 31.37,9.65 34.6,9.65 35.81,10.86 U1.1
  Top 0.406: U1.1 35.81,13.3 R5.1
GND  (via drill 0.5)  (7 unrouted)
  Top 0.254: 2.54,16.06 X3.SPRT@3 1.59,15.98 L.C | X3.BASE@2 3,10.13 X3.GND 5.22,8.26 X3.SPRT@2 5.04,7.83 X3.SPRT@4 | SW1.2 SW1.4 | U$4.35 21.88,11.9 U$4.THERMAL | U$4.THERMAL 23.88,9.9 U$4.42 20.07,9.9 18.67,11.3 18.67,12.32 v19.05,12.7 | U$4.5 23.38,8.9 | 23.38,8.9 U$4.THERMAL | U$4.18 24.38,9.4 U$4.THERMAL | C2.2 C4.2 | 23.38,8.9 23.37,8.89 v23.37,7.87 | U1.4 v32,13.97
  other vias: 2.41,11.43 8.38,7.62 4.95,22.1 8.26,4.45 15.11,9.65 18.41,17.27 22.35,9.65 24.13,11.43 25.91,9.53 33.53,15.75 30.48,2.67 11.94,17.91 34.8,8.51 34.29,17.65 46.35,1.4 27.94,2.54 33.02,2.79 28.83,13.21
  pour Top: 0,23.88 0,0 52.58,0 52.58,23.88
  pour Bottom: 52.2,0 0,0 0,24.89 52.2,24.89
MISO
  Top 0.254: U$4.21 30.02,10.9 30.35,10.57 30.35,9.91 31.11,9.14 32.38,9.14 33.91,7.62 33.91,3.43 34.8,2.54 35.56,2.54 JP1.4
MOSI  (via drill 0.5)
  Top 0.254: U$4.19 28.32,9.9 28.77,9.46 v28.96,9.46
  Bottom 0.254: JP1.5 34.29,3.43 30.99,6.73 30.99,9.53 30.61,9.91 29.4,9.91 v28.96,9.46
N$1  (4 unrouted)
N$2
  Top 0.254: L.A 5.04,17.23 5.59,17.78 R7.2
N$5
  Top 0.254: U$4.1 21.38,5.89 20.32,4.83 X2.P$1 18.34,4.83 17.65,5.52 C2.1
N$7
  Top 0.254: U$4.2 21.88,5.62 19.3,3.05 17.02,3.05 16.58,3.49 X2.P$2 16.58,6.45 C4.1
SCK  (via drill 0.5)
  Top 0.254: U$4.20 29.6,10.4 29.84,10.16 29.84,9.53 30.1,9.27 v30.1,8.95
  Bottom 0.254: v30.1,8.95 30.1,5.59 31.75,3.94 JP1.6
SCL  (via drill 0.5)
  Top 0.254: U$4.32 23.38,14.59 22.99,14.99 v22.99,15.62
  Bottom 0.254: JP3.11 41.91,20.7 41.53,20.32 35.56,20.32 35.05,19.81 30.86,19.81 30.35,19.3 28.57,19.3 27.56,18.29 27.56,16.76 27.18,16.38 23.75,16.38 v22.99,15.62
SDA  (via drill 0.5)
  Top 0.254: U$4.31 23.88,14.99 v24,15.11
  Bottom 0.254: JP3.12 42.67,19.81 35.81,19.81 35.31,19.3 31.11,19.3 30.61,18.8 28.83,18.8 28.07,18.03 28.07,16.51 27.43,15.88 24.77,15.88 v24,15.11
SW  (2 unrouted)
SWCLK  (via drill 0.39, 0.5)
  Top 0.254: U$4.45 18.94,8.4 v18.92,8.38 | X1.4 8.38,12.32 7.87,11.81 v7.87,8.76
  Bottom 0.254: v18.92,8.38 18.54,8.76 v7.87,8.76
SWDIO  (via drill 0.39, 0.5)
  Top 0.254: U$4.46 19.84,7.9 19.05,7.11 v18.92,7.11 | v9.65,8 X1.2
  Bottom 0.254: 19.05,7.11 v18.92,7.11 18.03,8 v9.65,8
VBUS
  Top 0.254: 5.19,12.7 X3.VBUS
  Top 0.406: 5.87,12.73 X3.VBUS 6,12.73 7.11,13.84 D1.A
VDDCORE
  Top 0.254: U$4.43 19.81,9.4 18.25,10.96 C1.1
VIN  (3 unrouted)

### Text on the board
tPlace: VIN | En | 5V | 13 | 12 | 11 | ~ | 10 | ~ | 9 | ~ | 6 | ~5 | SCL | SDA | #13 | Reset | RST | 3V | ARf | GND | A0 | A1 | A2 | A3 | A4 | A5 | SCK | MO | MI | RX | TX | GND
bPlace: En | 13 | 12 | 6 | ~ | 5 | SCL | SDA | BAT | USB | 11~ | 10~ | 9~ | SCK | MOSI | MISO | RST | 3V | ARf | GND | A0 | A1 | A2 | A3 | A4 | A5 | RX | TX | GND